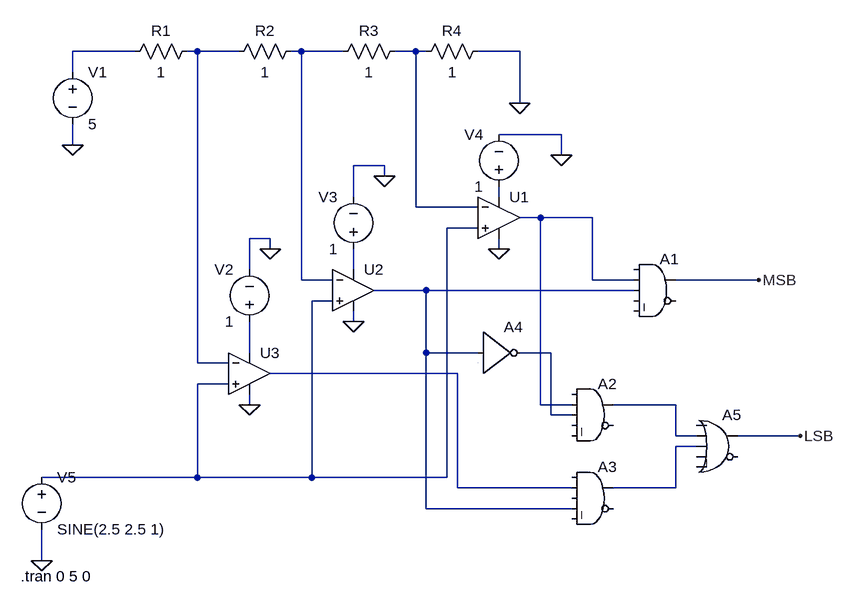
[diagram p0: schematic 2_Bit_ADC.asc]
2_Bit_ADC.asc, the LTspice schematic file:
Version 4.1
SHEET 1 1208 808
WIRE 0 -16 -96 -16
WIRE 96 -16 80 -16
WIRE 160 -16 96 -16
WIRE 256 -16 240 -16
WIRE 320 -16 256 -16
WIRE 432 -16 400 -16
WIRE 448 -16 432 -16
WIRE 592 -16 528 -16
WIRE -96 16 -96 -16
WIRE 592 64 592 -16
WIRE 656 112 560 112
WIRE -96 128 -96 96
WIRE 656 144 656 112
WIRE 384 160 336 160
WIRE 384 176 384 160
WIRE 336 208 336 160
WIRE 560 208 560 192
WIRE 432 224 432 -16
WIRE 528 224 432 224
WIRE 624 240 592 240
WIRE 704 240 624 240
WIRE 528 256 480 256
WIRE 208 272 176 272
WIRE 208 288 208 272
WIRE 560 288 560 272
WIRE 176 320 176 272
WIRE 336 320 336 288
WIRE 256 336 256 -16
WIRE 304 336 256 336
WIRE 704 336 704 240
WIRE 768 336 704 336
WIRE 960 336 832 336
WIRE 448 352 368 352
WIRE 768 352 448 352
WIRE 304 368 272 368
WIRE 336 400 336 384
WIRE 176 448 176 400
WIRE 448 448 448 352
WIRE 528 448 448 448
WIRE 640 448 592 448
WIRE 96 464 96 -16
WIRE 144 464 96 464
WIRE 496 480 208 480
WIRE 144 496 96 496
WIRE 176 528 176 512
WIRE 624 528 624 240
WIRE 672 528 624 528
WIRE 832 528 736 528
WIRE 640 544 640 448
WIRE 672 544 640 544
WIRE 832 576 832 528
WIRE 864 576 832 576
WIRE 1024 576 928 576
WIRE 864 592 832 592
WIRE 96 640 96 496
WIRE 96 640 -144 640
WIRE 272 640 272 368
WIRE 272 640 96 640
WIRE 480 640 480 256
WIRE 480 640 272 640
WIRE 496 656 496 480
WIRE 672 656 496 656
WIRE 832 656 832 592
WIRE 832 656 736 656
WIRE 448 688 448 448
WIRE 672 688 448 688
WIRE -144 768 -144 720
FLAG -96 128 0
FLAG 592 64 0
FLAG 560 288 0
FLAG 336 400 0
FLAG 176 528 0
FLAG 208 288 0
FLAG 384 176 0
FLAG 656 144 0
FLAG -144 768 0
FLAG 960 336 MSB
FLAG 1024 576 LSB
SYMBOL voltage -96 0 R0
WINDOW 123 0 0 Left 0
WINDOW 39 0 0 Left 0
SYMATTR InstName V1
SYMATTR Value 5
SYMBOL res 96 -32 R90
WINDOW 0 0 56 VBottom 2
WINDOW 3 32 56 VTop 2
SYMATTR InstName R1
SYMATTR Value 1
SYMBOL res 256 -32 R90
WINDOW 0 0 56 VBottom 2
WINDOW 3 32 56 VTop 2
SYMATTR InstName R2
SYMATTR Value 1
SYMBOL res 416 -32 R90
WINDOW 0 0 56 VBottom 2
WINDOW 3 32 56 VTop 2
SYMATTR InstName R3
SYMATTR Value 1
SYMBOL res 544 -32 R90
WINDOW 0 0 56 VBottom 2
WINDOW 3 32 56 VTop 2
SYMATTR InstName R4
SYMATTR Value 1
SYMBOL OpAmps\\UniversalOpAmp2 560 240 R0
SYMATTR InstName U1
SYMBOL OpAmps\\UniversalOpAmp2 336 352 R0
SYMATTR InstName U2
SYMBOL OpAmps\\UniversalOpAmp2 176 480 R0
SYMATTR InstName U3
SYMBOL voltage 176 416 R180
WINDOW 0 24 96 Left 2
WINDOW 3 24 16 Left 2
WINDOW 123 0 0 Left 0
WINDOW 39 0 0 Left 0
SYMATTR InstName V2
SYMATTR Value 1
SYMBOL voltage 336 304 R180
WINDOW 0 24 96 Left 2
WINDOW 3 24 16 Left 2
WINDOW 123 0 0 Left 0
WINDOW 39 0 0 Left 0
SYMATTR InstName V3
SYMATTR Value 1
SYMBOL voltage 560 208 R180
WINDOW 0 24 96 Left 2
WINDOW 3 24 16 Left 2
WINDOW 123 0 0 Left 0
WINDOW 39 0 0 Left 0
SYMATTR InstName V4
SYMATTR Value 1
SYMBOL voltage -144 624 R0
WINDOW 123 0 0 Left 0
WINDOW 39 0 0 Left 0
SYMATTR InstName V5
SYMATTR Value SINE(2.5 2.5 1)
SYMBOL Digital\\and 800 288 R0
SYMATTR InstName A1
SYMBOL Digital\\and 704 480 R0
SYMATTR InstName A2
SYMBOL Digital\\inv 528 384 R0
SYMATTR InstName A4
SYMBOL Digital\\and 704 608 R0
SYMATTR InstName A3
SYMBOL Digital\\or 896 528 R0
SYMATTR InstName A5
TEXT -176 792 Left 2 !.tran 0 5 0

The netlist it stands for:
* 2_Bit_ADC.asc
V1 N001 0 5
R1 N002 N001 1
R2 N003 N002 1
R3 N004 N003 1
R4 0 N004 1
X§U1 N007 N004 N005 0 N006 level2 Avol=1Meg GBW=10Meg Slew=10Meg Ilimit=25m Rail=0 Vos=0 En=0 Enk=0 In=0 Ink=0 Rin=500Meg  ; pins In+ In- V+ V- OUT
X§U2 N007 N003 N008 0 N009 level2 Avol=1Meg GBW=10Meg Slew=10Meg Ilimit=25m Rail=0 Vos=0 En=0 Enk=0 In=0 Ink=0 Rin=500Meg  ; pins In+ In- V+ V- OUT
X§U3 N007 N002 N010 0 N012 level2 Avol=1Meg GBW=10Meg Slew=10Meg Ilimit=25m Rail=0 Vos=0 En=0 Enk=0 In=0 Ink=0 Rin=500Meg  ; pins In+ In- V+ V- OUT
V2 N010 0 1
V3 N008 0 1
V4 N005 0 1
V5 N007 0 SINE(2.5 2.5 1)
A1 0 N006 N009 0 0 0 MSB 0 AND
A2 0 N006 N011 0 0 0 N013 0 AND
A4 N009 0 0 0 0 N011 0 0 BUF
A3 0 N012 0 N009 0 0 N014 0 AND
A5 0 N013 N014 0 0 0 LSB 0 OR
.tran 0 5 0
.lib UniversalOpAmp2.lib
.backanno
.end